# EAGLE schematic bb2 (EAGLE 6.5.0)
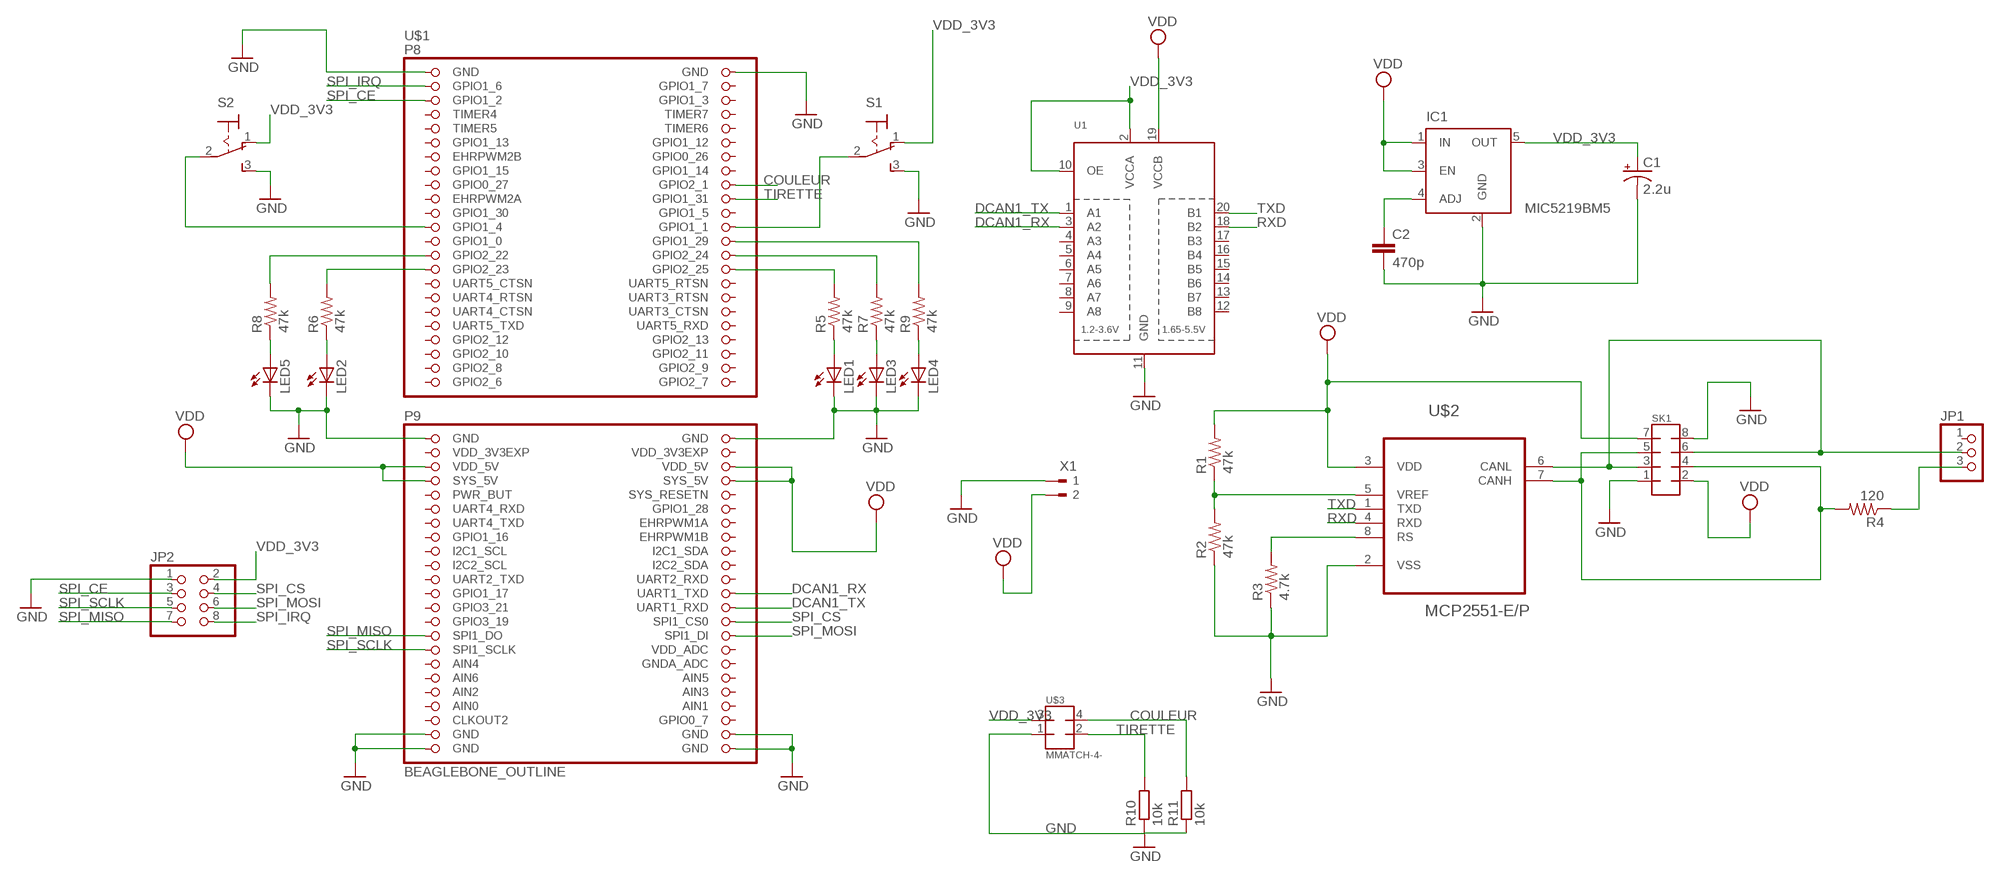
[diagram p0: schematic, sheet 1]

## Parts
C1  2.2u  CPOL-USE5-4  [E5-4]
C2  470p  C-EU025-040X050  [C025-040X050]
IC1  MIC5219BM5  [SOT23-5]
JP1  PINHD-1X3  [1X03]
JP2  PINHD-2X4  [2X04]
LED1  LED5MM  [LED5MM]
LED2  LED5MM  [LED5MM]
LED3  LED5MM  [LED5MM]
LED4  LED5MM  [LED5MM]
LED5  LED5MM  [LED5MM]
R1  47k  R-US_0207/9  [0207/9]
R2  47k  R-US_0207/9  [0207/9]
R3  4.7k  R-US_0207/9  [0207/9]
R4  120  R-US_0207/9  [0207/9]
R5  47k  R-US_0207/9  [0207/9]
R6  47k  R-US_0207/9  [0207/9]
R7  47k  R-US_0207/9  [0207/9]
R8  47k  R-US_0207/9  [0207/9]
R9  47k  R-US_0207/9  [0207/9]
R10  10k  R-EU_R0805  [R0805]
R11  10k  R-EU_R0805  [R0805]
S1  320-916  [320-916]
S2  320-916  [320-916]
SK1  MMATCH-8-PTH  [AMP-215079-8]
U1  TXB0108PWR  [TSSOP20]
U$1  BEAGLEBONE_OUTLINE  [BEAGLEBONE_SHIELD]
U$2  MCP2551-E/P  [DIP254P762X432-8]
U$3  MMATCH-4-  [AMP-215079-4]
X1  180G-2  [180G-2]

## Nets
COULEUR: R11.2 U$1.18(GPIO2_1) U$3.4
DCAN1_RX: U1.3(A2) U$1.70(UART1_TXD)
DCAN1_TX: U1.1(A1) U$1.72(UART1_RXD)
GND: C1.- C2.2 IC1.2(GND) JP2.1 LED1.K(C) LED2.K(C) LED3.K(C) LED4.K(C) LED5.K(C) R2.1 R3.1 R10.1 R11.1 S1.3(S) S2.3(S) SK1.1 SK1.8 U1.11(GND) U$1.1(GND) U$1.2(GND) U$1.47(GND) U$1.48(GND) U$1.89(GND) U$1.90(GND) U$1.91(GND) U$1.92(GND) U$2.2(VSS) U$3.1 X1.1
N$1: R1.1 R2.2 U$2.5(VREF)
N$2: JP1.3 R4.1
N$3: R3.2 U$2.8(RS)
N$4: C2.1 IC1.4(ADJ)
N$5: R5.2 U$1.30(GPIO2_25)
N$6: R6.2 U$1.29(GPIO2_23)
N$7: R7.2 U$1.28(GPIO2_24)
N$9: R9.2 U$1.26(GPIO1_29)
N$10: LED5.A R8.1
N$11: S1.2(P) U$1.24(GPIO1_1)
N$12: S2.2(P) U$1.23(GPIO1_4)
N$13: R8.2 U$1.27(GPIO2_22)
N$15: JP1.2 SK1.3 SK1.6 U$2.6(CANL)
N$16: R4.2 SK1.4 SK1.5 U$2.7(CANH)
N$19: LED2.A R6.1
N$20: LED1.A R5.1
N$21: LED3.A R7.1
N$22: LED4.A R9.1
RXD: U1.18(B2) U$2.4(RXD)
SPI_CE: JP2.3 U$1.5(GPIO1_2)
SPI_CS: JP2.4 U$1.74(SPI1_CS0)
SPI_IRQ: JP2.8 U$1.3(GPIO1_6)
SPI_MISO: JP2.7 U$1.75(SPI1_DO)
SPI_MOSI: JP2.6 U$1.76(SPI1_DI)
SPI_SCLK: JP2.5 U$1.77(SPI1_SCLK)
TIRETTE: R10.2 U$1.20(GPIO1_31) U$3.2
TXD: U1.20(B1) U$2.1(TXD)
VDD: IC1.1(IN) IC1.3(EN) R1.2 SK1.2 SK1.7 U1.19(VCCB) U$1.51(VDD_5V) U$1.52(VDD_5V) U$1.53(SYS_5V) U$1.54(SYS_5V) U$2.3(VDD) X1.2
VDD_3V3: C1.+ IC1.5(OUT) JP2.2 S1.1(O) S2.1(O) U1.2(VCCA) U1.10(OE) U$3.3
Unconnected: JP1.1 U1.4(A3) U1.5(A4) U1.6(A5) U1.7(A6) U1.8(A7) U1.9(A8) U1.12(B8) U1.13(B7) U1.14(B6) U1.15(B5) U1.16(B4) U1.17(B3) U$1.4(GPIO1_7) U$1.6(GPIO1_3) U$1.7(TIMER4) U$1.8(TIMER7) U$1.9(TIMER5) U$1.10(TIMER6) U$1.11(GPIO1_13) U$1.12(GPIO1_12) U$1.13(EHRPWM2B) U$1.14(GPIO0_26) U$1.15(GPIO1_15) U$1.16(GPIO1_14) U$1.17(GPIO0_27) U$1.19(EHRPWM2A) U$1.21(GPIO1_30) U$1.22(GPIO1_5) U$1.25(GPIO1_0) U$1.31(UART5_CTSN) U$1.32(UART5_RTSN) U$1.33(UART4_RTSN) U$1.34(UART3_RTSN) U$1.35(UART4_CTSN) U$1.36(UART3_CTSN) U$1.37(UART5_TXD) U$1.38(UART5_RXD) U$1.39(GPIO2_12) U$1.40(GPIO2_13) U$1.41(GPIO2_10) U$1.42(GPIO2_11) U$1.43(GPIO2_8) U$1.44(GPIO2_9) U$1.45(GPIO2_6) U$1.46(GPIO2_7) U$1.55(PWR_BUT) U$1.56(SYS_RESETN) U$1.57(UART4_RXD) U$1.58(GPIO1_28) U$1.59(UART4_TXD) U$1.60(EHRPWM1A) U$1.61(GPIO1_16) U$1.62(EHRPWM1B) U$1.63(I2C1_SCL) U$1.64(I2C1_SDA) U$1.65(I2C2_SCL) U$1.66(I2C2_SDA) U$1.67(UART2_TXD) U$1.68(UART2_RXD) U$1.69(GPIO1_17) U$1.71(GPIO3_21) U$1.73(GPIO3_19) U$1.78(VDD_ADC) U$1.79(AIN4) U$1.80(GNDA_ADC) U$1.81(AIN6) U$1.82(AIN5) U$1.83(AIN2) U$1.84(AIN3) U$1.86(AIN1) U$1.87(CLKOUT2) U$1.88(GPIO0_7)

## Power pins joined to a net without a drawn wire
AIN0: U$1.85(AIN0)
VDD_3V3EXP: U$1.49(VDD_3V3EXP) U$1.50(VDD_3V3EXP)

## Library data of the parts
C1 = resistor:CPOL-US: POLARIZED CAPACITOR, American symbol
C2 = resistor:C-EU: CAPACITOR, European symbol
IC1 = v-reg-micrel:MIC5219BM5: VOLTAGE REGULATOR; MF: ALTERA CORPORATION; MPN: MIC5219BM5 TR; OC_FARNELL: 1100656; OC_NEWARK: 09J8939
JP1 = adafruit:PINHD-1X3: PIN HEADER
JP2 = adafruit:PINHD-2X4: PIN HEADER
LED1-LED5 = adafruit:LED: LED OSRAM: - CHIPLED LG R971, LG N971, LY N971, LG Q971, LY Q971, LO R971, LY R971 LH N974, LH R974 LS Q976, LO Q976, LY Q976 LO Q996 - Hyper CHIPLED LW Q18S LB Q993, LB Q99A, LB R99A - SideLED LS A670, LO A670, LY A670, LG A670, LP A670 LB A673, LV A673, LT A673, LW A673 LH A674 LY A675 LS A676, LA A676, LO A676, LY A676, LW A676 LS A679, LY A679, LG A679 - Hyper Micro SIDELED® LS Y876, LA Y876, LO Y876, LY Y876 LT Y87S - SmartLED LW L88C, LW L88S LB L89C, LB L89S, LG L890 LS L89K, LO L89K, LY L89K LS L896, LA L896, LO L896, LY L896 - TOPLED LS T670, LO T670, LY T670, LG T670, LP T670 LSG T670, LSP T670, LSY T670, LOP T670, LYG T670 LG T671, LOG T671, LSG T671 LB T673, LV T673, LT T673, LW T673 LH T674 LS T676, LA T676, LO T676, LY T676, LB T676, LH T676, LSB T676, LW T676 LB T67C, LV T67C, LT T67C, LS T67K, LO T67K, LY T67K, LW E67C LS E67B, LA E67B, LO E67B, LY E67B, LB E67C, LV E67C, LT E67C LW T67C LS T679, LY T679, LG T679 LS T770, LO T770, LY T770, LG T770, LP T770 LB T773, LV T773, LT T773, LW T773 LH T774 LS E675, LA E675, LY E675, LS T675 LS T776, LA T776, LO T776, LY T776, LB T776 LHGB T686 LT T68C, LB T68C - Hyper Mini TOPLED® LB M676 - Mini TOPLED Santana® LG M470 LS M47K, LO M47K, LY M47K Source: http://www.osram.convergy.de/
R1-R9 = adafruit:R-US_: RESISTOR, American symbol
R10 R11 = rcl:R-EU_: RESISTOR, European symbol
S1 S2 = switch:320-916: TOGGLE SWITCH distributor RS Components
SK1 = jt-con-micromatch:MMATCH-8-*: AMP Micromatch 8-pin
U1 = adafruit:TXB0108PWR: 8-Bit Bi-Directional Level Shifter 1.2V-3.6V (VCCA) to 1.65V-5.5V (VCCB) bi-directional level shifter with auto direction sensing. Max data rate - VCCA 1.8V: 20Mbps (50ns), VCCA 3.3V: 100Mbps (10ns) Digikey: 296-21527-1-ND
U$1 = adafruit:BEAGLEBONE_OUTLINE: Should match A3 pinout - but not completely tested
U$2 = mcp2551:MCP2551-E/P: High-Speed CAN Transceiver; MPN: MCP2551-E/P; OC_FARNELL: 1439745; OC_NEWARK: 69K7603; PACKAGE: DIP-8; SUPPLIER: Microchip
U$3 = jt-con-micromatch:MMATCH-4-*
X1 = con-weidmueller-sl35:180G-2: WEIDMUELLER CLAMP CONNECTOR; OC_FARNELL: unknown; OC_NEWARK: unknown